# EasyEDA Pro project joil.eprj

# Schematic Schematic1
Board Name: Board1; Create Date: 2025-11-25; Page Name: P1; Project Name: joil; Schematic Name: Schematic1; Update Date: 2025-12-18; Company: EasyEDA.com; Page Size: A4; Version: V1.0
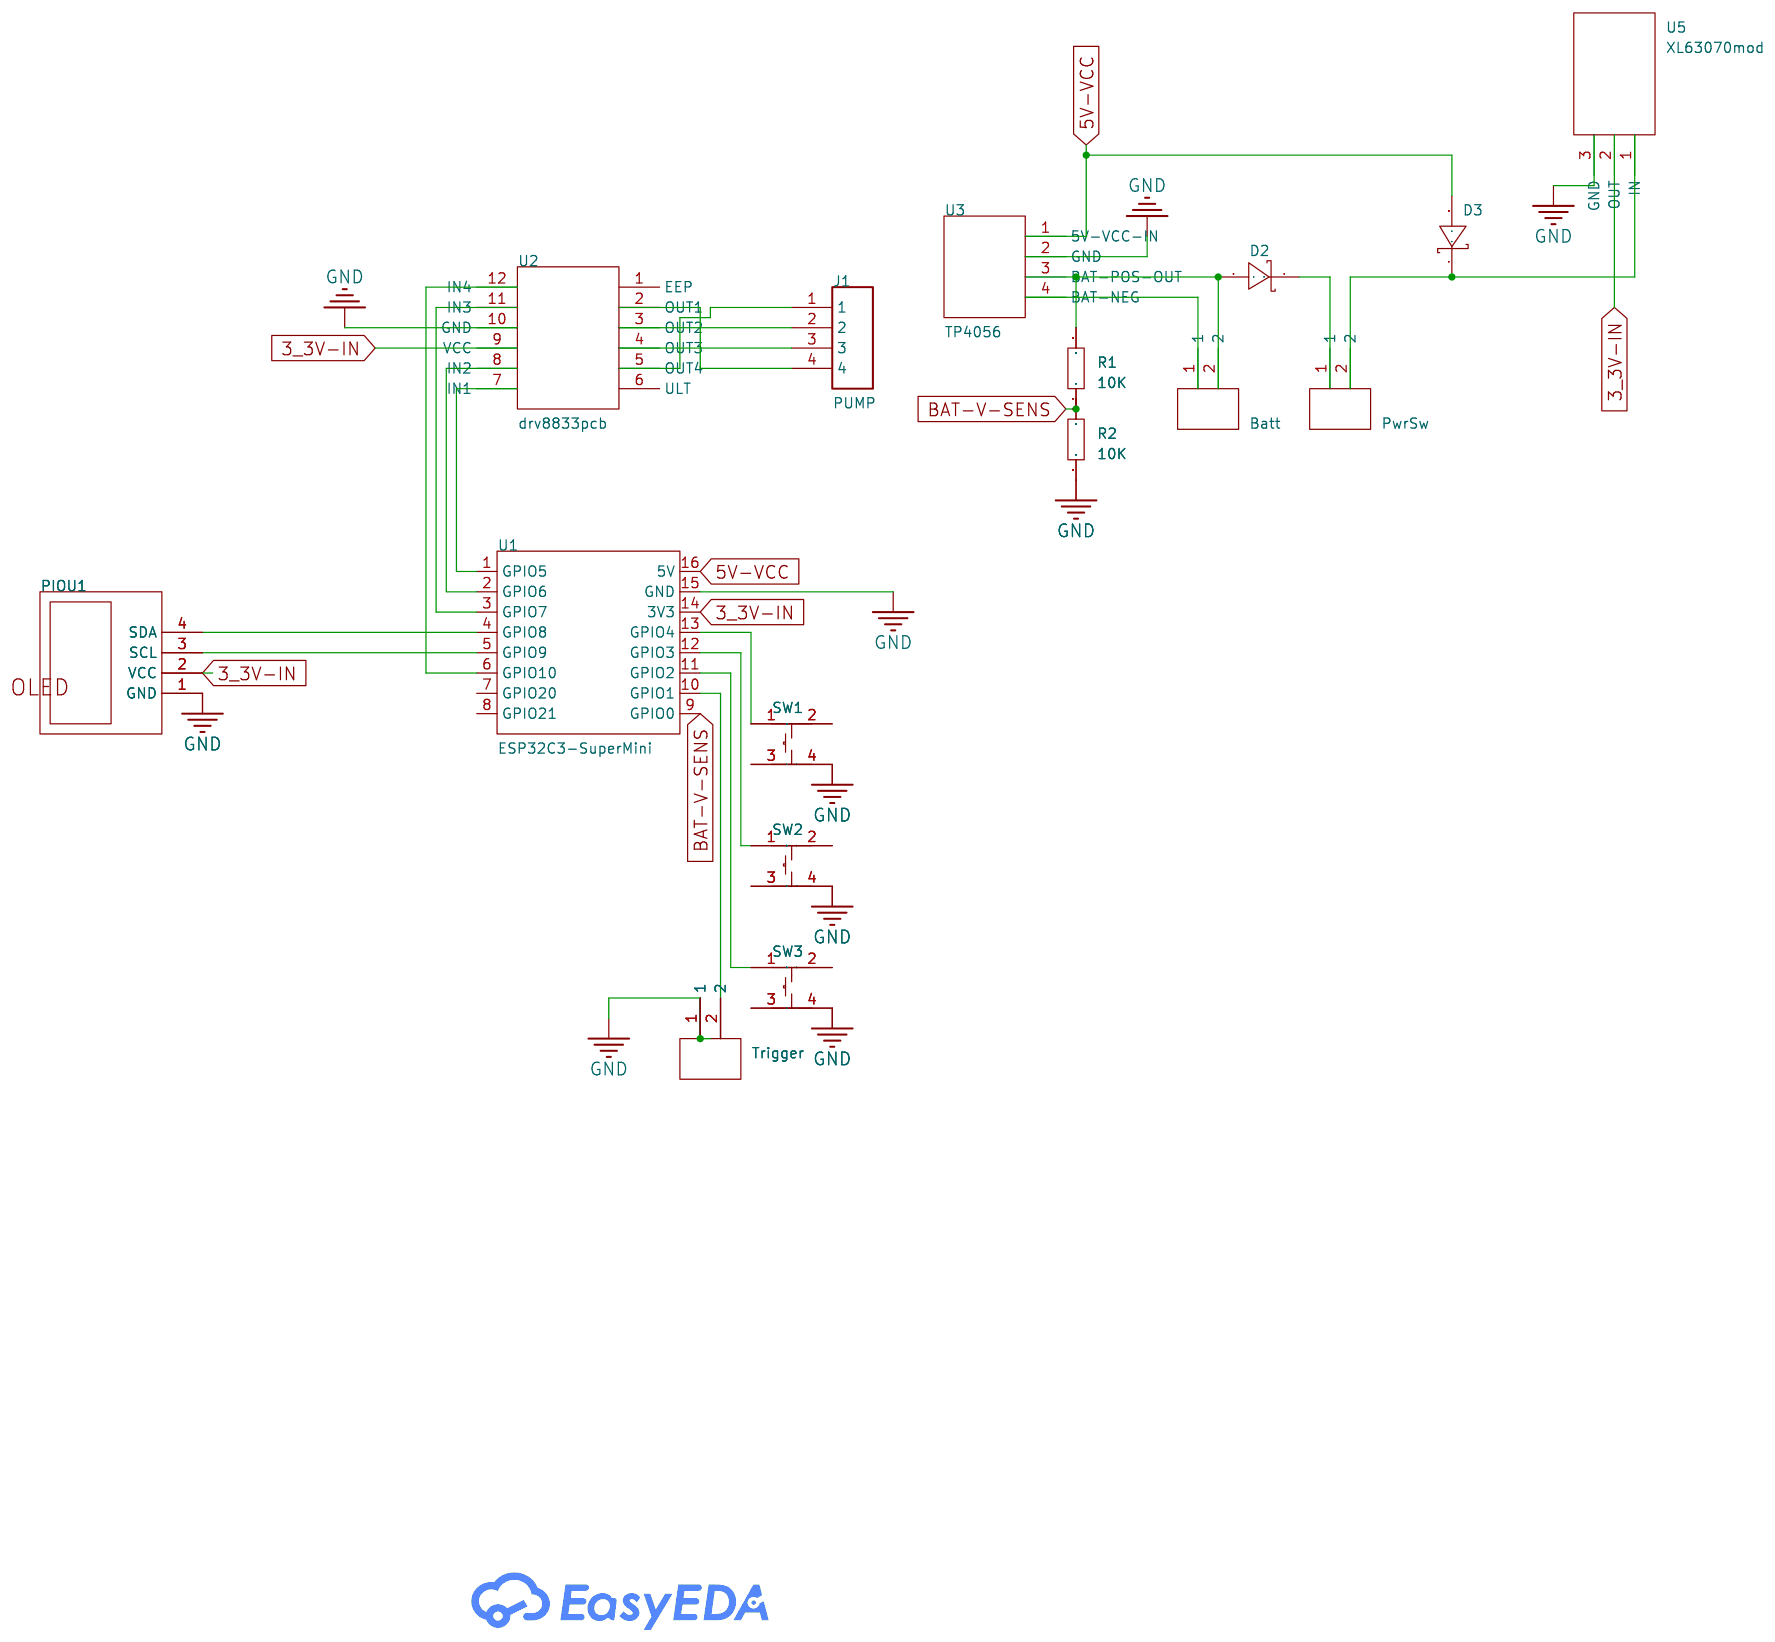
[diagram p0: schematic sheet]

## Parts
Batt  Batt  [jst2pin]
D2  SS14  [SOD-123FL_L2.8-W1.9-LS3.79-RD]
D3  SS14  [SOD-123FL_L2.8-W1.9-LS3.79-RD]
J1  PUMP  [SMD-JST-SH1.0-04PIN-VERTICAL]
PIOU1  GRINNAN_OLED 128X64 0,96" I2C 4PIN  [I2C - OLED 0.96" 128X64]
PwrSw  PwrSw  [jst2pin]
R1  10K  [0805]
R2  10K  [0805]
SW1  1TS005F-2500-5001  [KEY-SMD_4P-L6.0-W6.0-P4.50-LS9.0]
SW2  1TS005F-2500-5001  [KEY-SMD_4P-L6.0-W6.0-P4.50-LS9.0]
SW3  1TS005F-2500-5001  [KEY-SMD_4P-L6.0-W6.0-P4.50-LS9.0]
Trigger  Trigger  [jst2pin]
U1  ESP32C3-SuperMini  [Esp32c3 SuperMini]
U2  drv8833pcb  [DRV8833pcb]
U3  TP4056  [pwr]
U5  XL63070mod  [XL63070mod]

## Library data of the parts
Batt PwrSw Trigger = jst2pin
D2 D3 = SS14_C2480: Diode Configuration:Single Forward Voltage (Vf@If):0.55V@1A Reverse Voltage (Vr):40V Average Rectified Current (Io):1A Reverse Leakage Current (Ir):0.5mA@40V; LCSC Part Name: 电压:40V 电流:1A; Supplier Part: C2480; Manufacturer: MDD; Supplier Footprint: SMA(DO-214AC); JLCPCB Part Class: Basic Part; Datasheet: https://atta.szlcsc.com/upload/public/pdf/source/20230712/2DB6064CFBB99DE6DB116BEE8208BE66.pdf; Supplier: LCSC; Diode Configuration: Single; Forward Voltage (Vf@If): 0.55V@1A; Reverse Voltage (Vr): 40V; Average Rectified Current (Io): 1A; Reverse Leakage Current (Ir): 0.5mA@40V
J1 = JST-SH1.0-04PIN
PIOU1 = GRINNAN_OLED 128X64 0,96" I2C 4PIN: Manufacturer Part: SSD1306 I2C OLED
R1 R2 = Res_0603: Supplier Footprint: 0603
SW1-SW3 = 1TS005F-2500-5001: Supplier Part: C508476; Supplier Footprint: SMD,6x6x5mm; JLCPCB Part Class: Extended Part; Supplier: LCSC
U1 = ESP32C3-SuperMini: Supplier Part: C9900147397; Supplier Footprint: SMD-16P; JLCPCB Part Class: Extended Part; Supplier: LCSC
U2 = drv8833pcb
U3 = pwr
U5 = XL63070mod

## Nets
5V-VCC: D3.2(A) U1.16(5V) U3.1(5V-VCC-IN)
GND: PIOU1.1(GND) R2.1 SW1.4 SW2.4 SW3.4 Trigger.1 U1.15(GND) U2.10(GND) U3.2(GND) U5.3(GND)
3_3V-IN: PIOU1.2(VCC) U1.14(3V3) U2.9(VCC) U5.2(OUT)
BAT-V-SENS: R1.1 R2.2 U1.9(GPIO0)
$1N865: U1.1(GPIO5) U2.7(IN1)
$1N882: U1.2(GPIO6) U2.8(IN2)
$1N889: U1.3(GPIO7) U2.11(IN3)
$1N895: U1.6(GPIO10) U2.12(IN4)
$1N1115: SW1.1 U1.13(GPIO4)
$1N1125: SW2.1 U1.12(GPIO3)
$1N1131: SW3.1 U1.11(GPIO2)
$1N1322: Trigger.2 U1.10(GPIO1)
$1N1740: PIOU1.4(SDA) U1.4(GPIO8)
$1N1744: PIOU1.3(SCL) U1.5(GPIO9)
$1N2147: J1.4 U2.2(OUT1)
$1N2167: J1.1 U2.5(OUT4)
$1N2183: J1.3 U2.4(OUT3)
$1N2186: J1.2 U2.3(OUT2)
$1N4116: Batt.1 U3.4(BAT-NEG)
$1N4335: D3.1(K) PwrSw.2 U5.1(IN)
$1N4341: Batt.2 D2.2(A) R1.2 U3.3(BAT-POS-OUT)
$1N4561: D2.1(K) PwrSw.1

Not connected (* = marked no-connect by the designer): SW1 2 3; SW2 2 3; SW3 2 3; U1 7(GPIO20) 8(GPIO21); U2 1(EEP) 6(ULT)

# Board PCB1
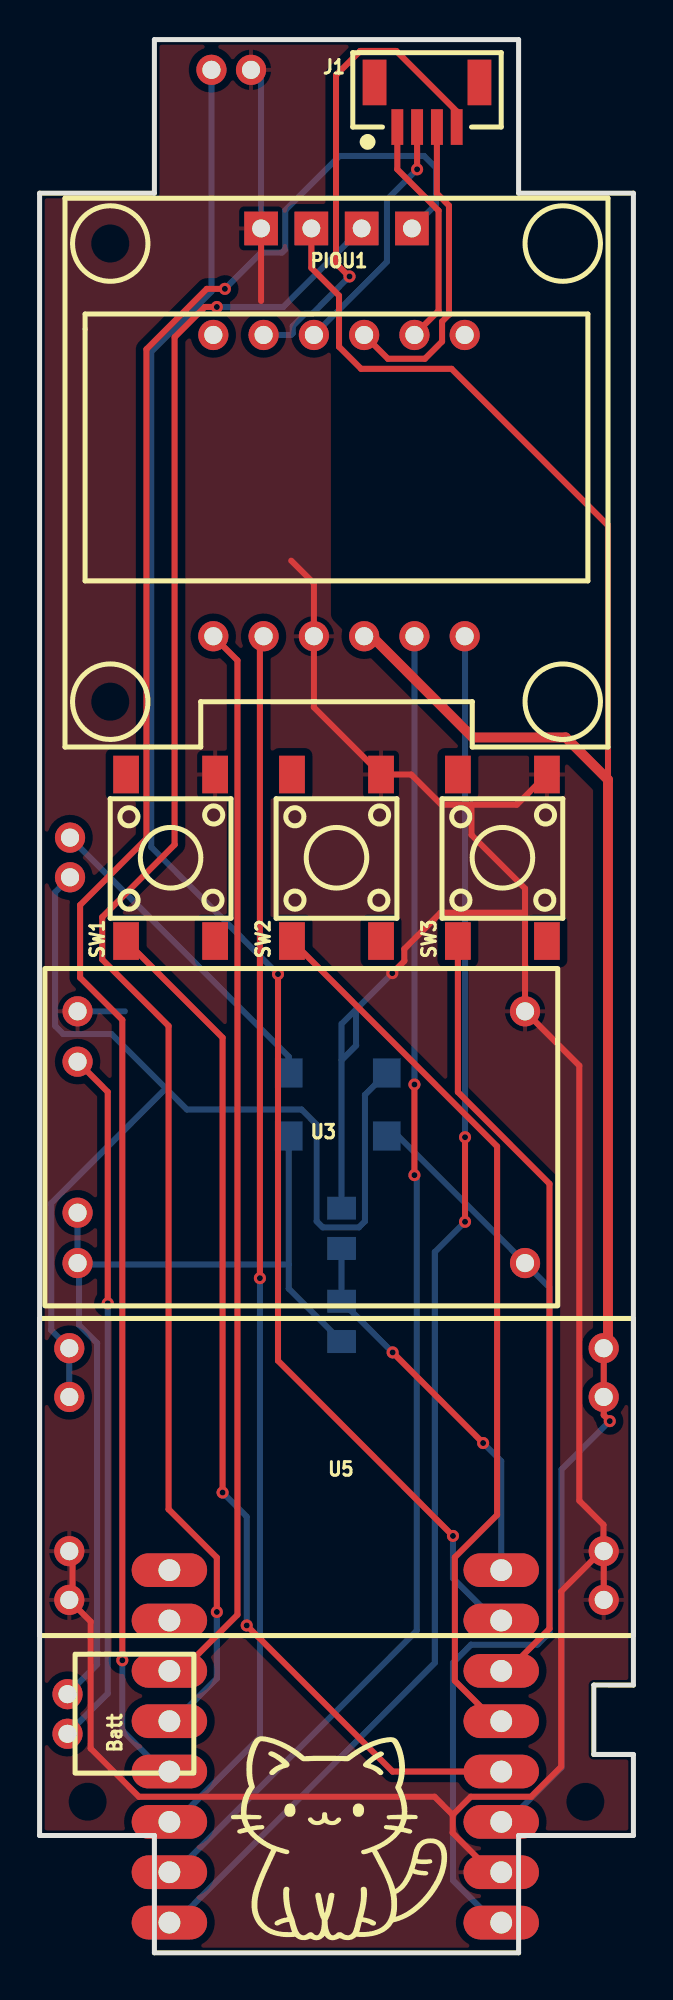
[diagram p1: board, top side]
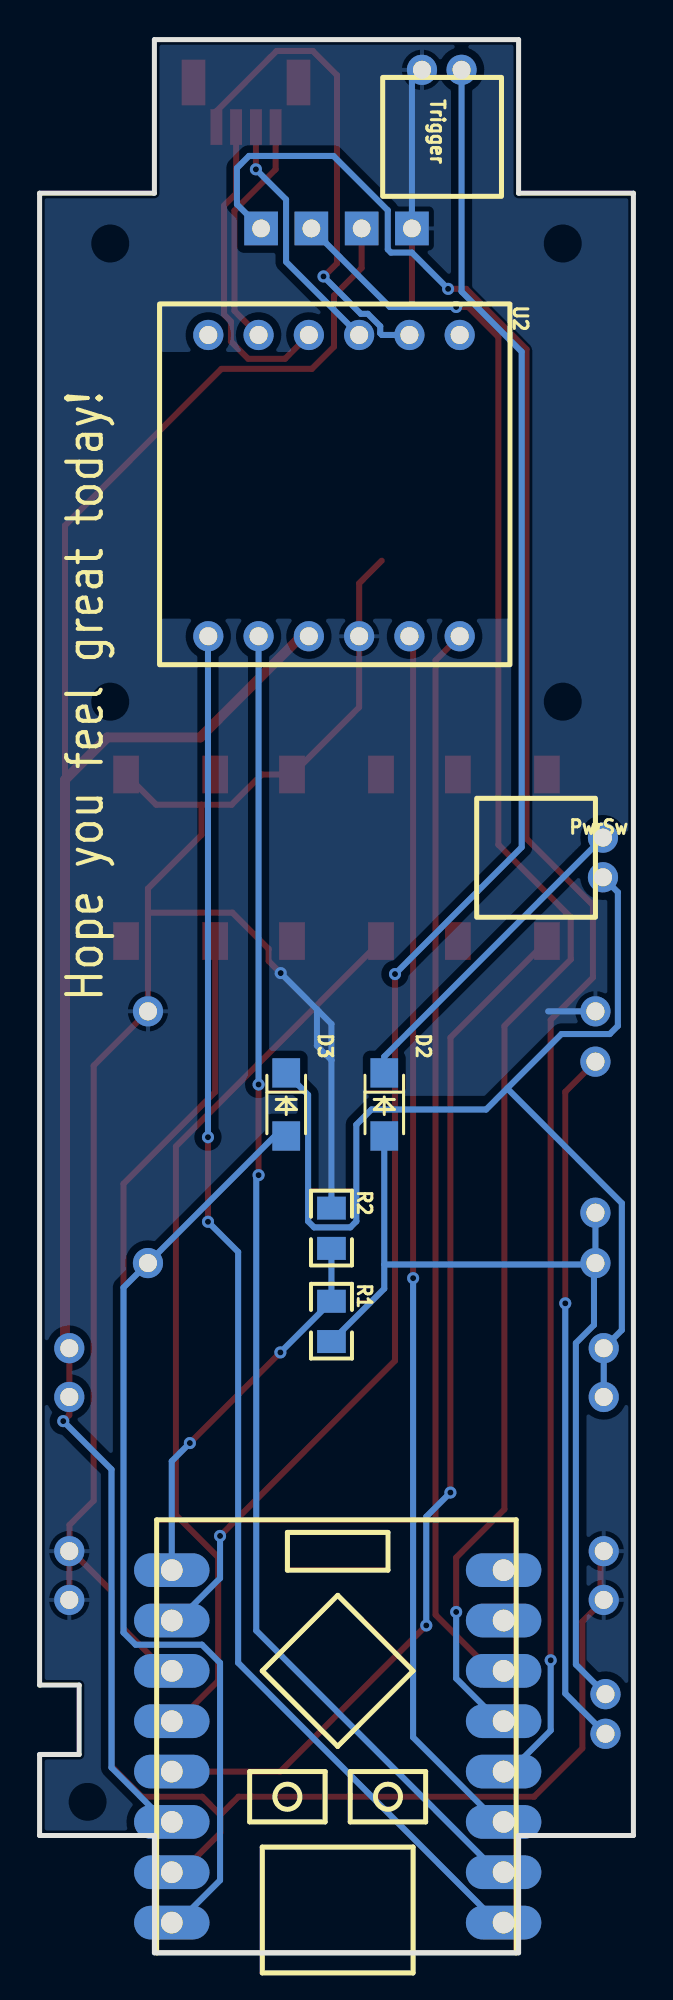
[diagram p2: board, bottom side, seen from below]

Outline 30 x 96.52 mm; copper layers: Top Layer, Bottom Layer. Coordinates in mm from the lower left corner of the outline.
Outline path: 0,88.77 0,5.92 5.8,5.92 5.8,0 24.2,0 24.2,5.92 30,5.92 30,10.01 28,10.01 28,13.51 30,13.51 30,88.77 24.2,88.77 24.2,96.52 5.8,96.52 5.8,88.77 0,88.77
Stack: Top Layer 0.035mm / Dielectric1 1.51mm FR4 er 4.5 / Bottom Layer 0.035mm

## Design rules (mm)
net 5V-VCC: power
net $1N2167: power
net $1N2147: power
net $1N2186: power
net $1N2183: power
net $1N4341: power
net $1N4116: power
net $1N4335: power
net $1N4561: power
template: Custom Config
spacing copperThickness1oz: track to track 0.102, other pairs 0.152 to 0.3
spacing copperThickness2oz (default): track to track 0.203, other pairs 0.152 to 0.3
track width copperThickness1oz: min 0.127, default 0.254, max 2.54
track width copperThickness2oz (default): min 0.254, default 0.305, max 2.54
track width copperThickness05mm: min 0.4, default 0.5, max 2.54
differential pair differentialPair (default): width min 0.127, default 0.254, max 2.54; gap min 0.152, default 0.152
via viaSize (default): diameter min 0.5, default 0.61, max 10; hole min 0.3, default 0.305, max 6.3

## Placement (name value [footprint] x y rotation side)
Batt  Batt  [jst2pin]  1.41 12.06 0 top
D2  SS14  [SOD-123FL_L2.8-W1.9-LS3.79-RD]  12.59 42.8 270 bottom
D3  SS14  [SOD-123FL_L2.8-W1.9-LS3.79-RD]  17.54 42.8 270 bottom
J1  PUMP  [SMD-JST-SH1.0-04PIN-VERTICAL]  19.57 94.36 0 top
PIOU1  GRINNAN_OLED 128X64 0,96" I2C 4PIN  [I2C - OLED 0.96" 128X64]  15 87 0 top
PwrSw  PwrSw  [jst2pin]  1.54 55.25 0 bottom
R1  10K  [0805]  15.25 31.85 270 bottom
R2  10K  [0805]  15.25 36.55 270 bottom
SW1  1TS005F-2500-5001  [KEY-SMD_4P-L6.0-W6.0-P4.50-LS9.0]  6.62 55.25 90 top
SW2  1TS005F-2500-5001  [KEY-SMD_4P-L6.0-W6.0-P4.50-LS9.0]  15 55.25 90 top
SW3  1TS005F-2500-5001  [KEY-SMD_4P-L6.0-W6.0-P4.50-LS9.0]  23.38 55.25 90 top
Trigger  Trigger  [jst2pin]  9.67 95 270 bottom
U1  ESP32C3-SuperMini  [Esp32c3 SuperMini]  7.32 1.52 0 bottom
U2  drv8833pcb  [DRV8833pcb]  8.78 81.66 270 bottom
U3  TP4056  [pwr]  13.22 41.15 90 top
U5  -  [XL63070mod]  15 24 0 top

## Footprints (pads in the part's own frame, mm; a bottom-side part is the same pattern mirrored in y, then rotated)
0805
  rect 1.16x1.45 smd: 1(-1.016,0) 2(1.016,0)
DRV8833pcb
  round 1.524 hole 0.914: 1(0.041,0) 2(0.041,-2.54) 3(0.041,-5.08) 4(0.041,-7.62) 5(0.041,-10.16) 6(0.041,-12.7) 7(15.24,-12.7) 8(15.24,-10.16) 9(15.24,-7.62) 10(15.24,-5.08) 11(15.24,-2.54) 12(15.24,0)
Esp32c3 SuperMini
  oval 3.81x1.7 hole 1.1: 1(-0.762,0) 2(-0.762,-2.54) 3(-0.762,-5.08) 4(-0.762,-7.62) 5(-0.762,-10.16) 6(-0.762,-12.7) 7(-0.762,-15.24) 8(-0.762,-17.78) 9(16.002,-17.78) 10(16.002,-15.24) 11(16.002,-12.7) 12(16.002,-10.16) 13(16.002,-7.62) 14(16.002,-5.08) 15(16.002,-2.54) 16(16.002,0)
I2C - OLED 0.96" 128X64
  rect 1.7x1.7 hole 0.9: 1(-3.81,0) 2(-1.27,0) 3(1.27,0) 4(3.81,0)
jst2pin
  round 1.524 hole 0.914: 1(0,-1.016) 2(0,0.984)
KEY-SMD_4P-L6.0-W6.0-P4.50-LS9.0
  rect 1.9x1.3 smd: 1(-4.2,2.25) 2(4.2,2.25) 3(-4.2,-2.25) 4(4.2,-2.25)
pwr
  round 1.524 hole 0.914: 1(-6.35,-11.303) 2(6.35,11.303) 2(6.35,-11.303) 3(-6.35,11.303) 3(-3.81,11.303) 4(3.81,11.303)
SMD-JST-SH1.0-04PIN-VERTICAL
  rect 1.2x2.3 smd: (-2.65,0) (2.65,0)
  rect 0.6x1.8 smd: 1(-1.5,-2.25) 2(-0.5,-2.25) 3(0.5,-2.25) 4(1.5,-2.25)
SOD-123FL_L2.8-W1.9-LS3.79-RD
  rect 1.48x1.4 smd: 1(-1.59,0) 2(1.59,0)
XL63070mod
  round 1.524 hole 0.914: 1(-13.5,6.5) 1(-13.5,4.04) 2(13.5,6.5) 2(13.5,4.04) 3(-13.5,-3.74) 3(-13.5,-6.2) 3(13.5,-3.74) 3(13.5,-6.2)

## Nets
As in the schematic.

Pads without a net: SW1 2 3; SW2 2 3; SW3 2 3; U1 7 8; U2 1 6

## Via types
v1: diameter 0.61, hole 0.305, Top Layer to Bottom Layer, 20 vias

## Routing (per net, layer and track width the routed paths; a pad name or vN(x,y) marks a point on that pad's centre or on a via; arc(x,y) is an arc through that point)
5V-VCC: length 48.6
  Bottom Layer w0.305: U1.16 23.02,1.52 20.88,3.66 20.88,14.63 21.8,15.54 25.15,15.54 25.76,16.15 25.76,33.56 U3.1 18.11,41.21 D3.2
GND: length 156.4
  Top Layer w0.305: 20.87,6.96 20.87,6.04 22.7,4.22 23.17,4.22 U1.15 ; 20.87,6.96 21.78,7.87 24.83,7.87 26.35,9.4 26.35,18.24 28.49,20.37 ; 20.87,6.96 19.95,7.87 5.02,7.87 2.58,10.31 2.58,16.71 1.66,17.63 1.66,17.93 ; 1.66,17.93 U5.3 ; 1.66,17.93 1.66,20.1 U5.3 ; 28.49,20.37 U5.3 U5.3 ; 28.49,20.37 28.49,21.59 27.27,22.81 27.27,44.75 U3.2 24.53,52.47 ; 24.53,52.47 20.26,52.47 18.43,50.65 18.43,50.04 v1(17.82,49.43) ; 24.53,52.47 24.53,53.69 21.82,56.4 21.82,57.92 ; 12.71,70.23 13.86,69.09 U2.10 13.86,62.84 SW2.4 18.77,59.45 20.3,57.92 21.82,57.92 ; 21.82,57.92 24.11,57.92 SW3.4 ; PIOU1.1 11.19,83.34
  Bottom Layer w0.305: Trigger.1 11.19,94.49 PIOU1.1 ; 15.25,45.03 15.99,45.77 15.99,47.6 ; 15.25,45.03 R2.1 ; 15.25,45.03 15.25,46.86 15.99,47.6 ; v1(17.82,49.43) 15.99,47.6 ; 4.31,47.5 U3.2
3_3V-IN: length 107.3
  Top Layer w0.305: PIOU1.2 13.73,85 15.13,83.61 15.13,81.03 16.24,79.91 20.81,79.91 28.72,72.01 28.72,59.18 ; U5.2 U5.2 28.5,27.13 v1(28.81,26.82)
  Top Layer w0.5: U2.9 16.78,66.42 21.88,61.32 26.58,61.32 28.72,59.18 28.72,31.1 28.5,30.88 U5.2
  Bottom Layer w0.305: U1.14 23.63,6.6 26.37,9.34 26.37,24.39 v1(28.81,26.82)
BAT-V-SENS: length 19.6
  Top Layer w0.305: v1(22.41,25.72) v1(17.84,30.29)
  Bottom Layer w0.305: U1.9 23.32,24.8 v1(22.41,25.72) ; R2.2 R1.1 v1(17.84,30.29)
$1N865: length 71.3
  Top Layer w0.305: v1(21.49,36.88) v1(21.49,41.15)
  Bottom Layer w0.305: U1.1 6.86,1.52 19.97,14.63 19.97,35.36 v1(21.49,36.88) ; v1(21.49,41.15) 21.49,66.41 U2.7
$1N882: length 67.8
  Top Layer w0.305: v1(18.94,39.23) v1(18.94,43.81)
  Bottom Layer w0.305: v1(18.94,43.81) U2.8 ; U1.2 6.86,4.06 19.06,16.26 19.06,39.12 v1(18.94,39.23)
$1N889: length 62
  Top Layer w0.305: U2.11 11.13,66.23 v1(11.13,34.04)
  Bottom Layer w0.305: U1.3 6.86,6.6 11.13,10.87 v1(11.13,34.04)
$1N895: length 54.5
  Top Layer w0.305: U2.12 10,65.2 10,17.05 7.17,14.22 U1.6
$1N1115: length 53
  Top Layer w0.305: v1(9.25,23.22) 9.25,46.17 SW1.1 ; v1(10.46,16.52) 17.84,9.14 U1.13
  Bottom Layer w0.305: v1(9.25,23.22) 10.46,22 v1(10.46,16.52)
$1N1125: length 45.7
  Top Layer w0.305: SW2.1 23.11,40.68 23.11,22.09 20.98,19.96 20.98,13.72 23.02,11.68 U1.12
$1N1131: length 39.9
  Top Layer w0.305: SW3.1 21.13,43.42 25.76,38.8 25.76,16.35 23.63,14.22 U1.11
$1N1322: length 87
  Top Layer w0.305: v1(20.88,21.03) 12.04,29.87 v1(12.04,49.38)
  Bottom Layer w0.305: v1(20.88,21.03) 20.88,18.9 23.02,16.76 U1.10 ; v1(12.04,49.38) 5.64,55.78 5.64,80.77 8.68,83.81 Trigger.2
$1N1740: length 98.8
  Top Layer w0.305: v1(4.18,14.76) 4.18,47.07 2.05,49.2 2.05,52.86 5.4,56.21 5.4,80.9 8.45,83.95 v1(9.36,83.95)
  Bottom Layer w0.305: PIOU1.4 20.03,88.21 20.03,90.04 19.42,90.65 15.15,90.65 12.41,87.91 12.41,85.94 12.25,85.78 11.19,85.78 v1(9.36,83.95) ; v1(4.18,14.76) 4.18,11.22 6.25,9.14 U1.4
$1N1744: length 86.6
  Top Layer w0.305: v1(8.96,83.03) 8.34,83.03 6.82,81.51 6.82,55.91 3.16,52.25 3.16,50.11 6.52,46.76 6.52,22.38 8.96,19.94 v1(8.96,17.2)
  Bottom Layer w0.305: v1(8.96,17.2) 8.96,13.84 6.8,11.68 U1.5 ; PIOU1.3 12.31,83.03 v1(8.96,83.03)
$1N2147: length 24.9
  Top Layer w0.305: 15.63,84.57 14.98,85.23 14.98,94.73 16.2,95.95 18.02,95.95 21.07,92.9 J1.4
  Bottom Layer w0.305: v1(15.66,84.57) 13.77,82.69 13.42,82.69 12.79,82.06 12.79,81.71 12.71,81.62 U2.2
$1N2167: length 11.9
  Top Layer w0.305: U2.5 20.16,82.84 20.16,87.89 18.07,89.98 J1.1
$1N2183: length 16
  Top Layer w0.305: U2.4 17.6,80.42 19.46,80.42 20.33,81.29 20.33,82.3 20.68,82.65 20.68,88.15 20.07,88.76 J1.3
$1N2186: length 12.7
  Top Layer w0.305: J1.2 v1(19.07,89.98)
  Bottom Layer w0.305: U2.3 17.55,85.31 17.55,88.45 v1(19.07,89.98)
$1N4116: length 35.4
  Top Layer w0.305: U3.4 3.44,43.43 v1(3.44,32.77)
  Bottom Layer w0.305: Batt.1 3.44,13.08 v1(3.44,32.77)
$1N4335: length 56.9
  Bottom Layer w0.305: 6.38,43.61 7.44,42.55 13.23,42.55 14,41.78 14,36.9 14.3,36.6 16.13,36.6 16.44,36.9 16.44,43.28 D3.1 ; 6.38,43.61 0.59,37.82 0.59,31.42 U5.1 U5.1 ; 6.38,43.61 3.63,46.35 1.19,46.35 0.78,46.76 0.78,53.51 PwrSw.2
$1N4341: length 47.4
  Bottom Layer w0.305: R1.2 12.59,33.51 12.59,34.72 ; 12.59,34.72 1.99,34.72 ; 12.59,34.72 D2.2 ; 1.99,34.72 U3.3 U3.3 ; 1.99,34.72 1.99,31.68 2.91,30.76 2.91,14.54 Batt.2
$1N4561: length 16.4
  Bottom Layer w0.305: PwrSw.1 12.59,45.21 D2.1

## Copper pours and planes (outline as drawn; the poured copper is in the pictures)
GND on Top Layer: -11.92,101.35 43.07,101.35 43.07,-2.92 -11.92,-2.92
GND on Bottom Layer: -11.03,100.33 41.8,100.33 41.8,-1.02 -11.03,-1.02

## Text on the board
Bottom Silkscreen Layer: Hope you feel great today!
